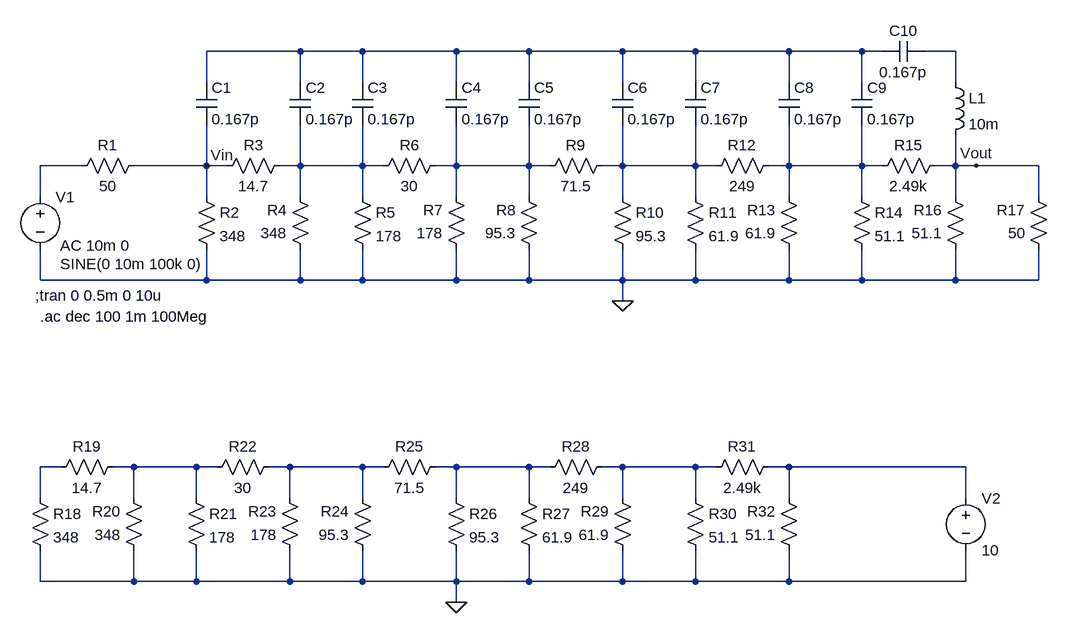
[diagram p0: schematic AttentuatorDesign2.asc]
AttentuatorDesign2.asc, the LTspice schematic file:
Version 4
SHEET 1 1624 980
WIRE 112 -80 -32 -80
WIRE 208 -80 112 -80
WIRE 352 -80 208 -80
WIRE 464 -80 352 -80
WIRE 608 -80 464 -80
WIRE 720 -80 608 -80
WIRE 864 -80 720 -80
WIRE 976 -80 864 -80
WIRE 1008 -80 976 -80
WIRE 1120 -80 1072 -80
WIRE -32 -32 -32 -80
WIRE 112 -32 112 -80
WIRE 208 -32 208 -80
WIRE 352 -32 352 -80
WIRE 464 -32 464 -80
WIRE 608 -32 608 -80
WIRE 720 -32 720 -80
WIRE 864 -32 864 -80
WIRE 976 -32 976 -80
WIRE 1120 -32 1120 -80
WIRE -224 96 -288 96
WIRE -32 96 -32 32
WIRE -32 96 -144 96
WIRE 0 96 -32 96
WIRE 112 96 112 32
WIRE 112 96 80 96
WIRE 208 96 208 32
WIRE 208 96 112 96
WIRE 240 96 208 96
WIRE 352 96 352 32
WIRE 352 96 320 96
WIRE 464 96 464 32
WIRE 464 96 352 96
WIRE 496 96 464 96
WIRE 608 96 608 32
WIRE 608 96 576 96
WIRE 720 96 720 32
WIRE 720 96 608 96
WIRE 752 96 720 96
WIRE 864 96 864 32
WIRE 864 96 832 96
WIRE 976 96 976 32
WIRE 976 96 864 96
WIRE 1008 96 976 96
WIRE 1120 96 1120 48
WIRE 1120 96 1088 96
WIRE 1152 96 1120 96
WIRE 1248 96 1152 96
WIRE -288 144 -288 96
WIRE -32 144 -32 96
WIRE 112 144 112 96
WIRE 208 144 208 96
WIRE 352 144 352 96
WIRE 464 144 464 96
WIRE 608 144 608 96
WIRE 720 144 720 96
WIRE 864 144 864 96
WIRE 976 144 976 96
WIRE 1120 144 1120 96
WIRE 1248 144 1248 96
WIRE -288 272 -288 224
WIRE -32 272 -32 224
WIRE -32 272 -288 272
WIRE 112 272 112 224
WIRE 112 272 -32 272
WIRE 208 272 208 224
WIRE 208 272 112 272
WIRE 352 272 352 224
WIRE 352 272 208 272
WIRE 464 272 464 224
WIRE 464 272 352 272
WIRE 608 272 608 224
WIRE 608 272 464 272
WIRE 720 272 720 224
WIRE 720 272 608 272
WIRE 864 272 864 224
WIRE 864 272 720 272
WIRE 976 272 976 224
WIRE 976 272 864 272
WIRE 1120 272 1120 224
WIRE 1120 272 976 272
WIRE 1248 272 1248 224
WIRE 1248 272 1120 272
WIRE 608 304 608 272
WIRE -256 560 -288 560
WIRE -144 560 -176 560
WIRE -48 560 -144 560
WIRE -16 560 -48 560
WIRE 96 560 64 560
WIRE 208 560 96 560
WIRE 240 560 208 560
WIRE 352 560 320 560
WIRE 464 560 352 560
WIRE 496 560 464 560
WIRE 608 560 576 560
WIRE 720 560 608 560
WIRE 752 560 720 560
WIRE 864 560 832 560
WIRE 1136 560 864 560
WIRE -288 608 -288 560
WIRE -144 608 -144 560
WIRE -48 608 -48 560
WIRE 96 608 96 560
WIRE 208 608 208 560
WIRE 352 608 352 560
WIRE 464 608 464 560
WIRE 608 608 608 560
WIRE 720 608 720 560
WIRE 864 608 864 560
WIRE 1136 608 1136 560
WIRE -288 736 -288 688
WIRE -144 736 -144 688
WIRE -144 736 -288 736
WIRE -48 736 -48 688
WIRE -48 736 -144 736
WIRE 96 736 96 688
WIRE 96 736 -48 736
WIRE 208 736 208 688
WIRE 208 736 96 736
WIRE 352 736 352 688
WIRE 352 736 208 736
WIRE 464 736 464 688
WIRE 464 736 352 736
WIRE 608 736 608 688
WIRE 608 736 464 736
WIRE 720 736 720 688
WIRE 720 736 608 736
WIRE 864 736 864 688
WIRE 864 736 720 736
WIRE 1136 736 1136 688
WIRE 1136 736 864 736
WIRE 352 768 352 736
FLAG 608 304 0
FLAG 352 768 0
FLAG -32 96 Vin
FLAG 1152 96 Vout
SYMBOL voltage -288 128 R0
WINDOW 3 31 119 Left 2
WINDOW 123 31 91 Left 2
WINDOW 39 0 0 Left 0
SYMATTR Value SINE(0 10m 100k 0)
SYMATTR Value2 AC 10m 0
SYMATTR InstName V1
SYMBOL res -128 80 R90
WINDOW 0 0 56 VBottom 2
WINDOW 3 32 56 VTop 2
SYMATTR InstName R1
SYMATTR Value 50
SYMBOL res -48 128 R0
SYMATTR InstName R2
SYMATTR Value 348
SYMBOL res 96 80 R90
WINDOW 0 0 56 VBottom 2
WINDOW 3 32 56 VTop 2
SYMATTR InstName R3
SYMATTR Value 14.7
SYMBOL res 128 240 R180
WINDOW 0 36 76 Left 2
WINDOW 3 36 40 Left 2
SYMATTR InstName R4
SYMATTR Value 348
SYMBOL res 192 128 R0
SYMATTR InstName R5
SYMATTR Value 178
SYMBOL res 336 80 R90
WINDOW 0 0 56 VBottom 2
WINDOW 3 32 56 VTop 2
SYMATTR InstName R6
SYMATTR Value 30
SYMBOL res 368 240 R180
WINDOW 0 36 76 Left 2
WINDOW 3 36 40 Left 2
SYMATTR InstName R7
SYMATTR Value 178
SYMBOL res 480 240 R180
WINDOW 0 36 76 Left 2
WINDOW 3 36 40 Left 2
SYMATTR InstName R8
SYMATTR Value 95.3
SYMBOL res 480 112 R270
WINDOW 0 32 56 VTop 2
WINDOW 3 0 56 VBottom 2
SYMATTR InstName R9
SYMATTR Value 71.5
SYMBOL res 592 128 R0
SYMATTR InstName R10
SYMATTR Value 95.3
SYMBOL res 704 128 R0
SYMATTR InstName R11
SYMATTR Value 61.9
SYMBOL res 848 80 R90
WINDOW 0 0 56 VBottom 2
WINDOW 3 32 56 VTop 2
SYMATTR InstName R12
SYMATTR Value 249
SYMBOL res 880 240 R180
WINDOW 0 36 76 Left 2
WINDOW 3 36 40 Left 2
SYMATTR InstName R13
SYMATTR Value 61.9
SYMBOL res 960 128 R0
SYMATTR InstName R14
SYMATTR Value 51.1
SYMBOL res 1104 80 R90
WINDOW 0 0 56 VBottom 2
WINDOW 3 32 56 VTop 2
SYMATTR InstName R15
SYMATTR Value 2.49k
SYMBOL res 1136 240 R180
WINDOW 0 36 76 Left 2
WINDOW 3 36 40 Left 2
SYMATTR InstName R16
SYMATTR Value 51.1
SYMBOL res 1264 240 R180
WINDOW 0 36 76 Left 2
WINDOW 3 36 40 Left 2
SYMATTR InstName R17
SYMATTR Value 50
SYMBOL res -304 592 R0
SYMATTR InstName R18
SYMATTR Value 348
SYMBOL res -160 544 R90
WINDOW 0 0 56 VBottom 2
WINDOW 3 32 56 VTop 2
SYMATTR InstName R19
SYMATTR Value 14.7
SYMBOL res -128 704 R180
WINDOW 0 36 76 Left 2
WINDOW 3 36 40 Left 2
SYMATTR InstName R20
SYMATTR Value 348
SYMBOL res -64 592 R0
SYMATTR InstName R21
SYMATTR Value 178
SYMBOL res 80 544 R90
WINDOW 0 0 56 VBottom 2
WINDOW 3 32 56 VTop 2
SYMATTR InstName R22
SYMATTR Value 30
SYMBOL res 112 704 R180
WINDOW 0 36 76 Left 2
WINDOW 3 36 40 Left 2
SYMATTR InstName R23
SYMATTR Value 178
SYMBOL res 224 704 R180
WINDOW 0 36 76 Left 2
WINDOW 3 36 40 Left 2
SYMATTR InstName R24
SYMATTR Value 95.3
SYMBOL res 224 576 R270
WINDOW 0 32 56 VTop 2
WINDOW 3 0 56 VBottom 2
SYMATTR InstName R25
SYMATTR Value 71.5
SYMBOL res 336 592 R0
SYMATTR InstName R26
SYMATTR Value 95.3
SYMBOL res 448 592 R0
SYMATTR InstName R27
SYMATTR Value 61.9
SYMBOL res 592 544 R90
WINDOW 0 0 56 VBottom 2
WINDOW 3 32 56 VTop 2
SYMATTR InstName R28
SYMATTR Value 249
SYMBOL res 624 704 R180
WINDOW 0 36 76 Left 2
WINDOW 3 36 40 Left 2
SYMATTR InstName R29
SYMATTR Value 61.9
SYMBOL res 704 592 R0
SYMATTR InstName R30
SYMATTR Value 51.1
SYMBOL res 848 544 R90
WINDOW 0 0 56 VBottom 2
WINDOW 3 32 56 VTop 2
SYMATTR InstName R31
SYMATTR Value 2.49k
SYMBOL res 880 704 R180
WINDOW 0 36 76 Left 2
WINDOW 3 36 40 Left 2
SYMATTR InstName R32
SYMATTR Value 51.1
SYMBOL voltage 1136 592 R0
WINDOW 123 0 0 Left 0
WINDOW 39 0 0 Left 0
SYMATTR InstName V2
SYMATTR Value 10
SYMBOL cap -48 -32 R0
SYMATTR InstName C1
SYMATTR Value 0.167p
SYMBOL cap 96 -32 R0
SYMATTR InstName C2
SYMATTR Value 0.167p
SYMBOL cap 192 -32 R0
SYMATTR InstName C3
SYMATTR Value 0.167p
SYMBOL cap 336 -32 R0
SYMATTR InstName C4
SYMATTR Value 0.167p
SYMBOL cap 448 -32 R0
SYMATTR InstName C5
SYMATTR Value 0.167p
SYMBOL cap 592 -32 R0
SYMATTR InstName C6
SYMATTR Value 0.167p
SYMBOL cap 704 -32 R0
SYMATTR InstName C7
SYMATTR Value 0.167p
SYMBOL cap 848 -32 R0
SYMATTR InstName C8
SYMATTR Value 0.167p
SYMBOL cap 960 -32 R0
SYMATTR InstName C9
SYMATTR Value 0.167p
SYMBOL cap 1072 -96 R90
WINDOW 0 0 32 VBottom 2
WINDOW 3 32 32 VTop 2
SYMATTR InstName C10
SYMATTR Value 0.167p
SYMBOL ind 1104 -48 R0
SYMATTR InstName L1
SYMATTR Value 10m
TEXT -296 296 Left 2 !;tran 0 0.5m 0 10u
TEXT -288 328 Left 2 !.ac dec 100 1m 100Meg

The netlist it stands for:
* AttentuatorDesign2.asc
V1 N003 0 SINE(0 10m 100k 0) AC 10m 0
R1 Vin N003 50
R2 Vin 0 348
R3 N004 Vin 14.7
R4 0 N004 348
R5 N004 0 178
R6 N005 N004 30
R7 0 N005 178
R8 0 N005 95.3
R9 N005 N006 71.5
R10 N006 0 95.3
R11 N006 0 61.9
R12 N007 N006 249
R13 0 N007 61.9
R14 N007 0 51.1
R15 Vout N007 2.49k
R16 0 Vout 51.1
R17 0 Vout 50
R18 N008 0 348
R19 N009 N008 14.7
R20 0 N009 348
R21 N009 0 178
R22 N010 N009 30
R23 0 N010 178
R24 0 N010 95.3
R25 N010 N011 71.5
R26 N011 0 95.3
R27 N011 0 61.9
R28 N012 N011 249
R29 0 N012 61.9
R30 N012 0 51.1
R31 N013 N012 2.49k
R32 0 N013 51.1
V2 N013 0 10
C1 N001 Vin 0.167p
C2 N001 N004 0.167p
C3 N001 N004 0.167p
C4 N001 N005 0.167p
C5 N001 N005 0.167p
C6 N001 N006 0.167p
C7 N001 N006 0.167p
C8 N001 N007 0.167p
C9 N001 N007 0.167p
C10 N002 N001 0.167p
L1 N002 Vout 10m
;tran 0 0.5m 0 10u
.ac dec 100 1m 100Meg
.backanno
.end